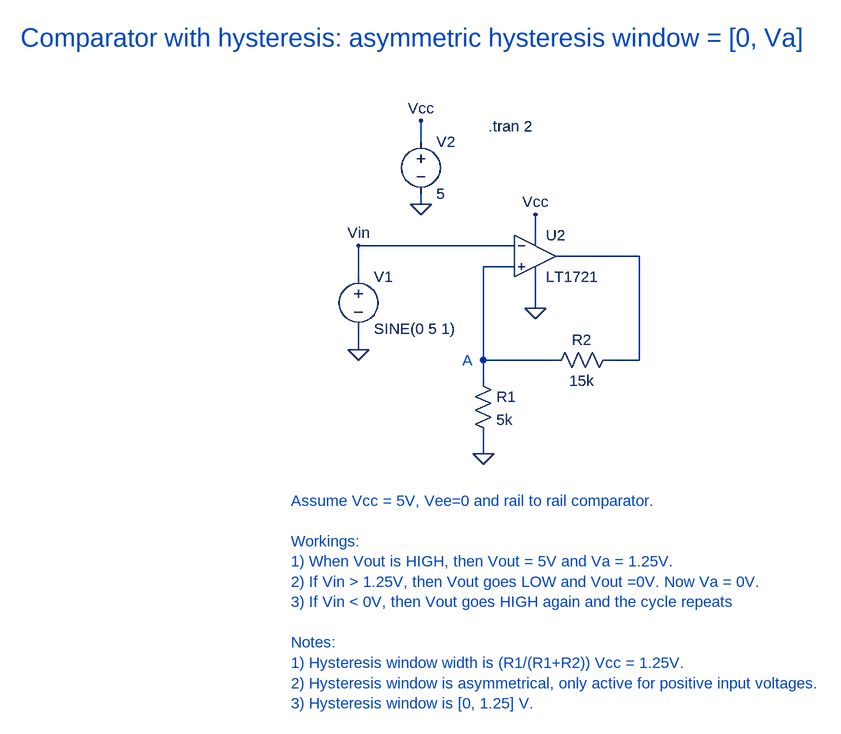
[diagram p0: schematic Comparator-with-hysteresis-asymmetrical-window.asc]
Comparator-with-hysteresis-asymmetrical-window.asc, the LTspice schematic file:
Version 4.1
SHEET 1 1492 816
WIRE 112 -32 112 -64
WIRE 112 64 112 48
WIRE 288 112 288 80
WIRE 256 128 16 128
WIRE 448 144 320 144
WIRE 256 160 208 160
WIRE 16 176 16 128
WIRE 288 224 288 176
WIRE 16 288 16 256
WIRE 208 304 208 160
WIRE 320 304 208 304
WIRE 448 304 448 144
WIRE 448 304 400 304
WIRE 208 336 208 304
WIRE 208 448 208 416
FLAG 112 64 0
FLAG 112 -64 Vcc
FLAG 288 80 Vcc
FLAG 16 288 0
FLAG 208 448 0
FLAG 288 224 0
FLAG 16 128 Vin
SYMBOL voltage 16 160 R0
WINDOW 123 0 0 Left 0
WINDOW 39 0 0 Left 0
SYMATTR InstName V1
SYMATTR Value SINE(0 5 1)
SYMBOL voltage 112 -48 R0
WINDOW 123 0 0 Left 0
WINDOW 39 0 0 Left 0
SYMATTR InstName V2
SYMATTR Value 5
SYMBOL res 192 320 R0
SYMATTR InstName R1
SYMATTR Value 5k
SYMBOL res 416 288 R90
WINDOW 0 0 56 VBottom 2
WINDOW 3 32 56 VTop 2
SYMATTR InstName R2
SYMATTR Value 15k
SYMBOL Comparators\\LT1721 288 80 R0
SYMATTR InstName U2
TEXT 216 -56 Left 2 !.tran 2
TEXT -504 -192 Left 4 ;Comparator with hysteresis: asymmetric hysteresis window = [0, Va]
TEXT 176 304 Left 2 ;A
TEXT -88 520 Left 2 ;Assume Vcc = 5V, Vee=0 and rail to rail comparator.\n \nWorkings:\n1) When Vout is HIGH, then Vout = 5V and Va = 1.25V.\n2) If Vin > 1.25V, then Vout goes LOW and Vout =0V. Now Va = 0V.\n3) If Vin < 0V, then Vout goes HIGH again and the cycle repeats\n \nNotes:\n1) Hysteresis window width is (R1/(R1+R2)) Vcc = 1.25V.\n2) Hysteresis window is asymmetrical, only active for positive input voltages.\n3) Hysteresis window is [0, 1.25] V.

The netlist it stands for:
* Comparator-with-hysteresis-asymmetrical-window.asc
V1 Vin 0 SINE(0 5 1)
V2 Vcc 0 5
R1 N002 0 5k
R2 N001 N002 15k
X§U2 N002 Vin Vcc 0 N001 LT1720  ; LT1721, pins In+ In- V+ V- OUT
.tran 2
* Comparator with hysteresis: asymmetric hysteresis window = [0, Va]
* A
* Assume Vcc = 5V, Vee=0 and rail to rail comparator.
* Workings:
* 1) When Vout is HIGH, then Vout = 5V and Va = 1.25V.
* 2) If Vin > 1.25V, then Vout goes LOW and Vout =0V. Now Va = 0V.
* 3) If Vin < 0V, then Vout goes HIGH again and the cycle repeats
* Notes:
* 1) Hysteresis window width is (R1/(R1+R2)) Vcc = 1.25V.
* 2) Hysteresis window is asymmetrical, only active for positive input voltages.
* 3) Hysteresis window is [0, 1.25] V.
.lib LTC.lib
.backanno
.end